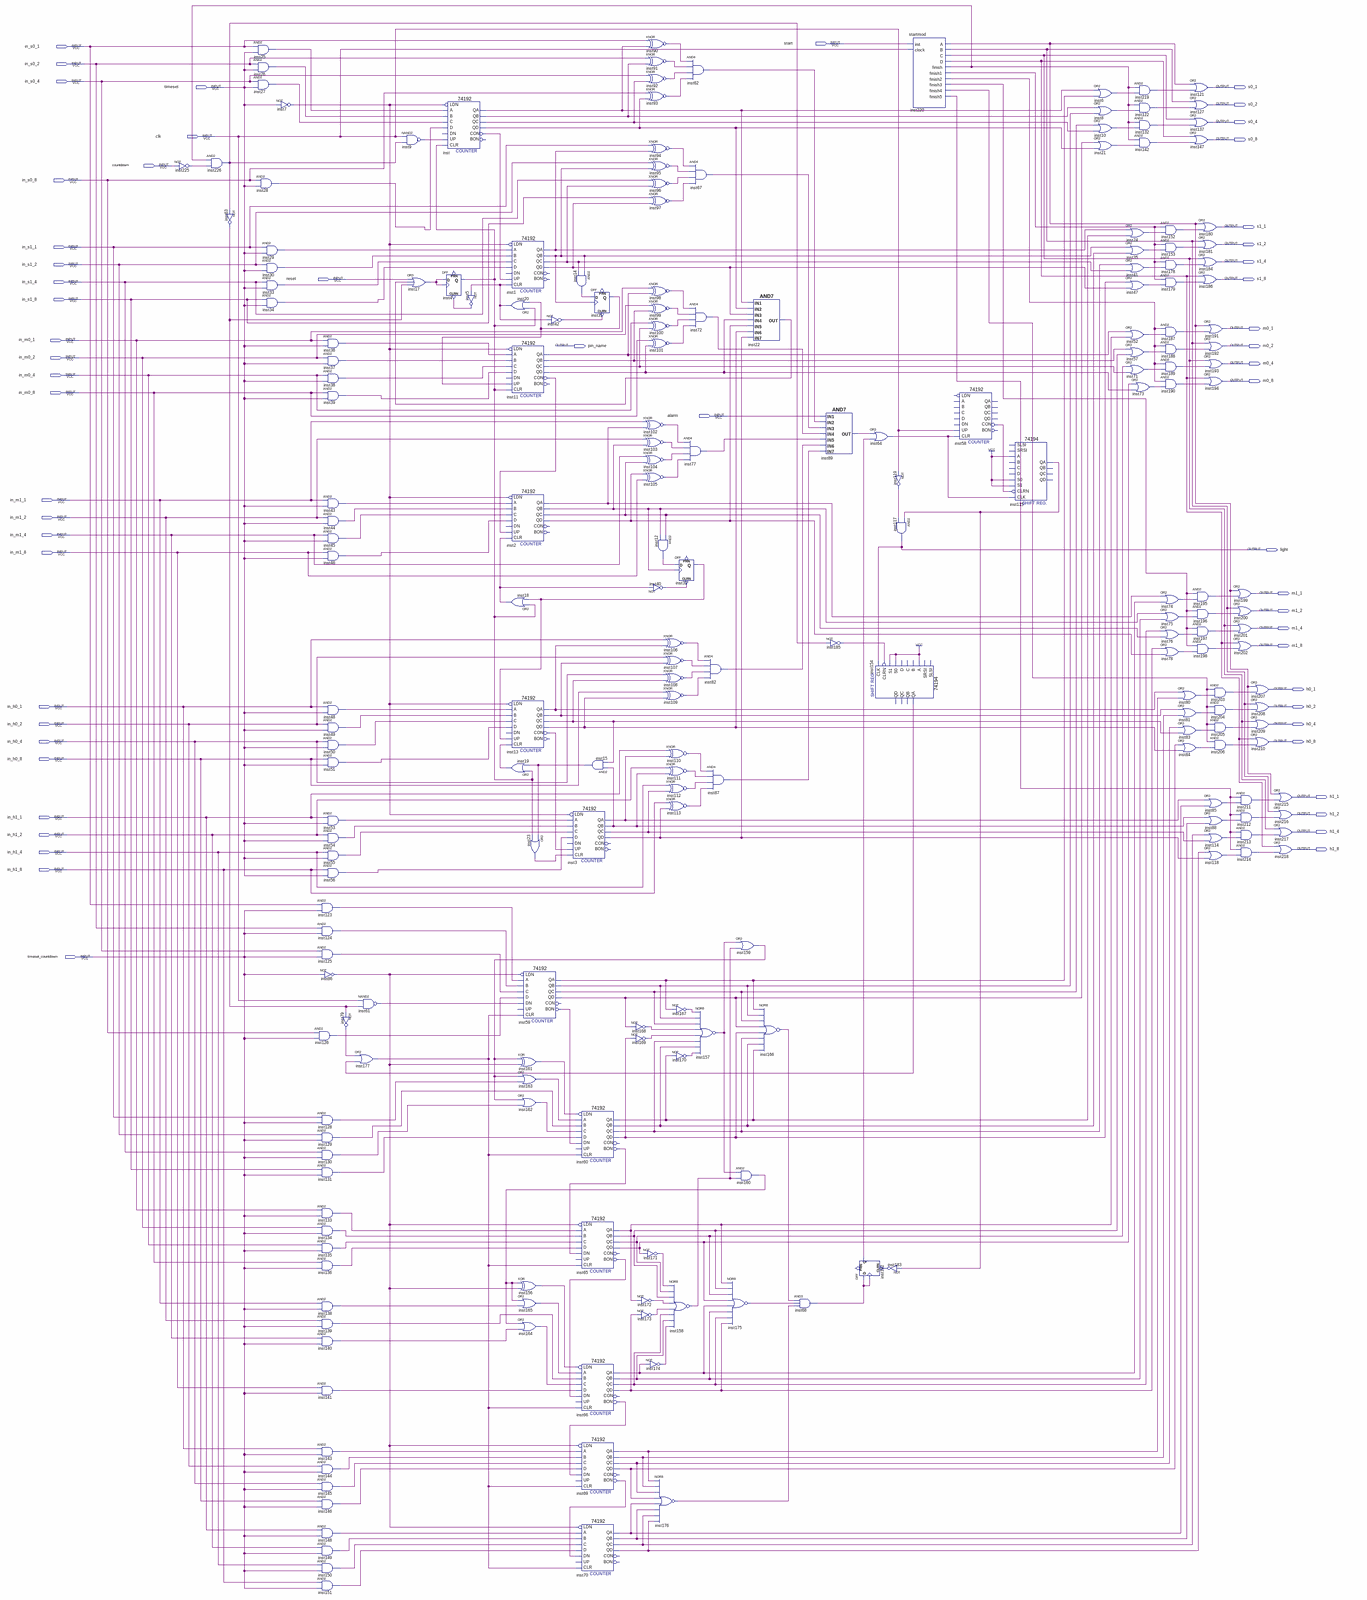
[diagram p0: schematic sheet, whole]
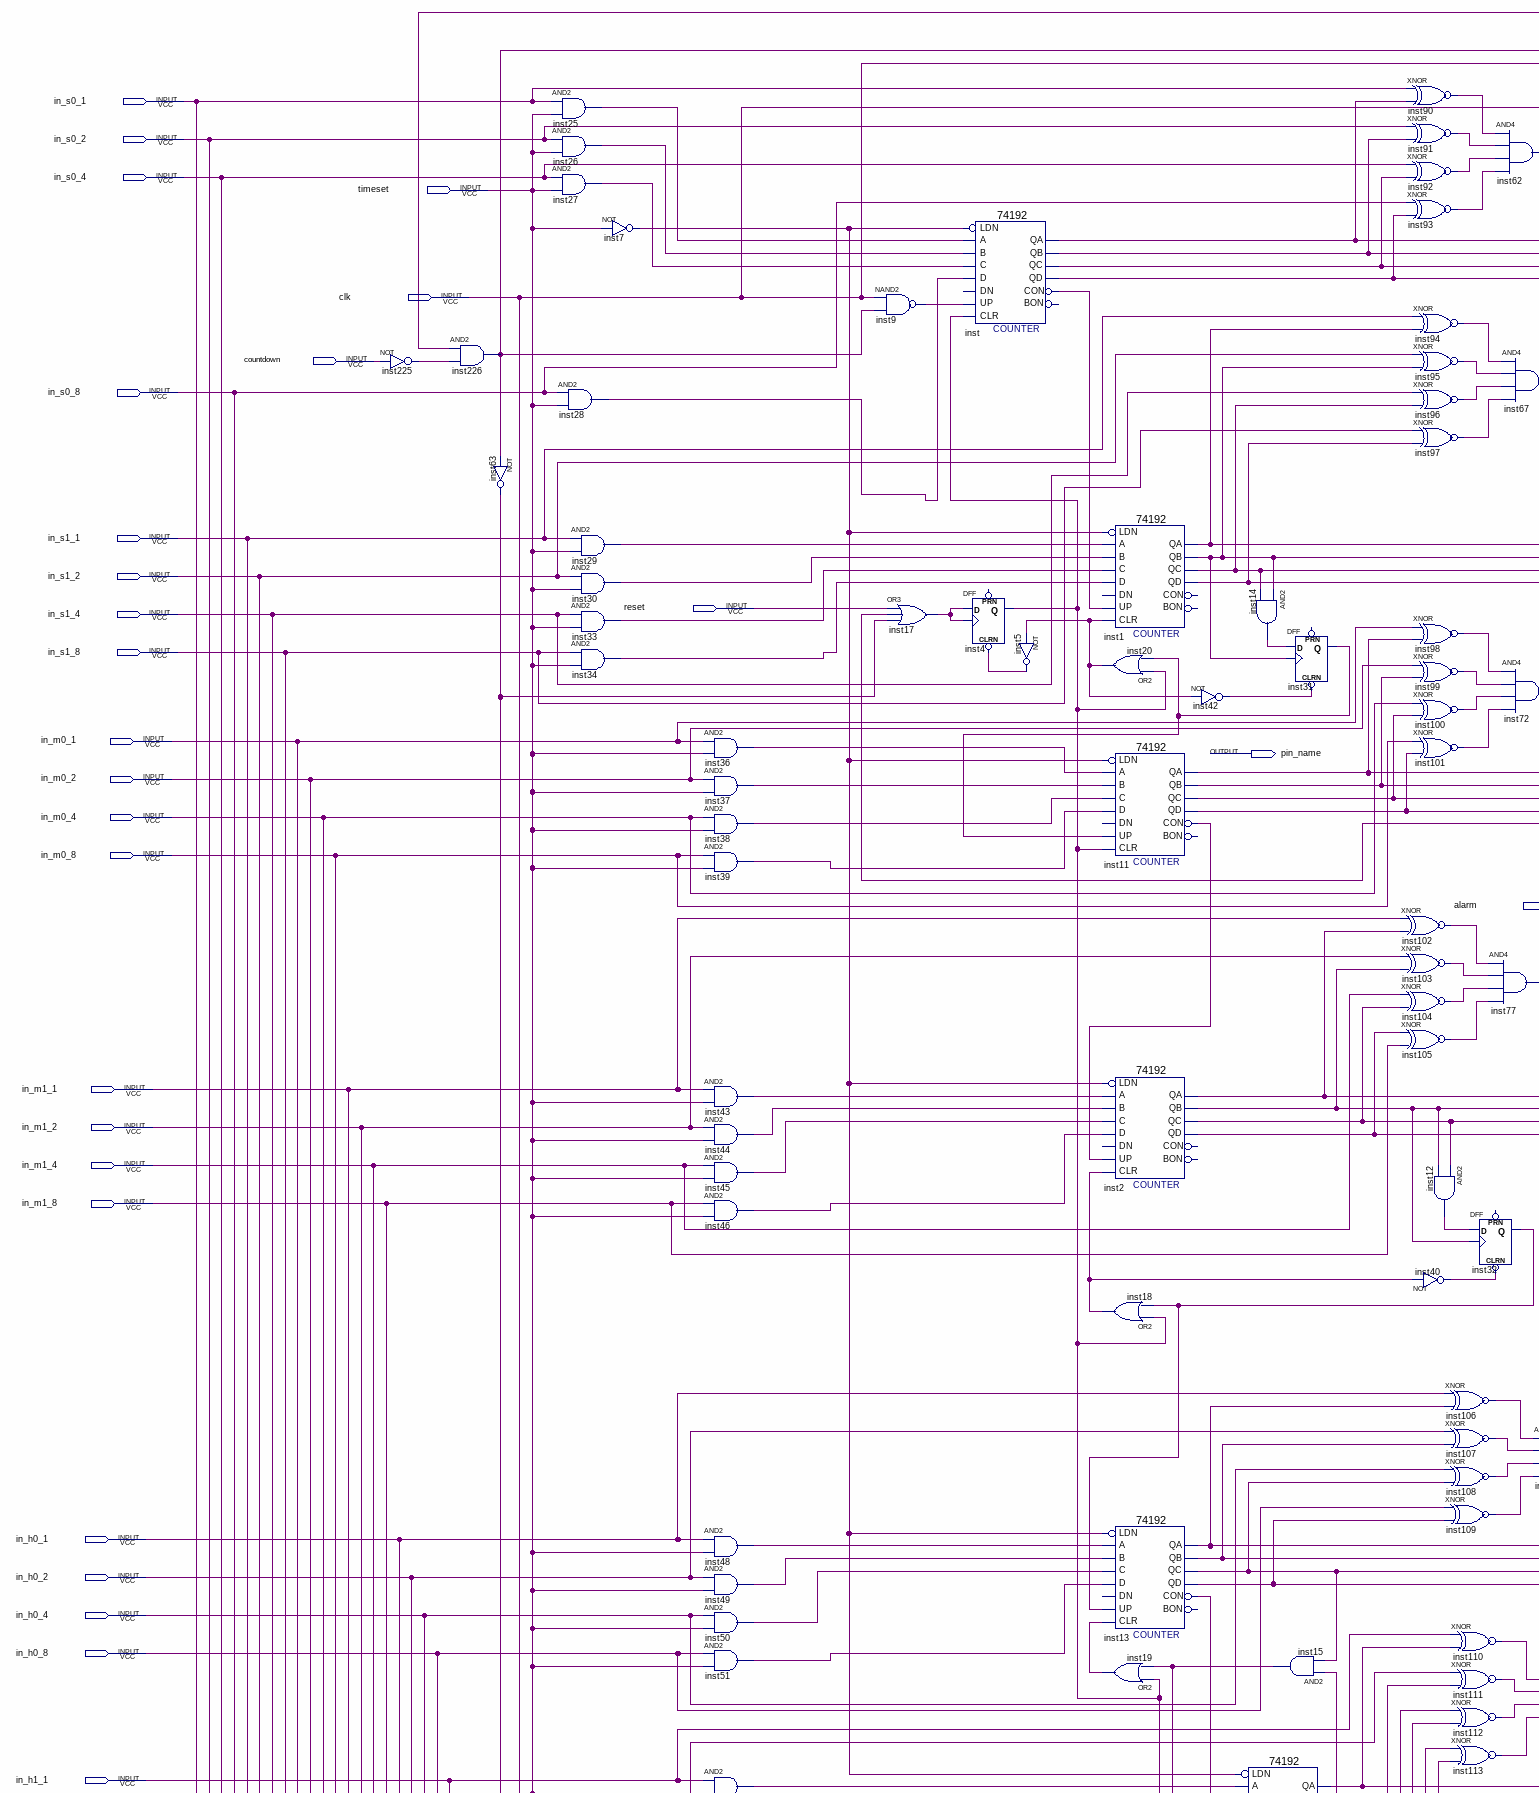
[diagram p1: schematic sheet, upper left part]
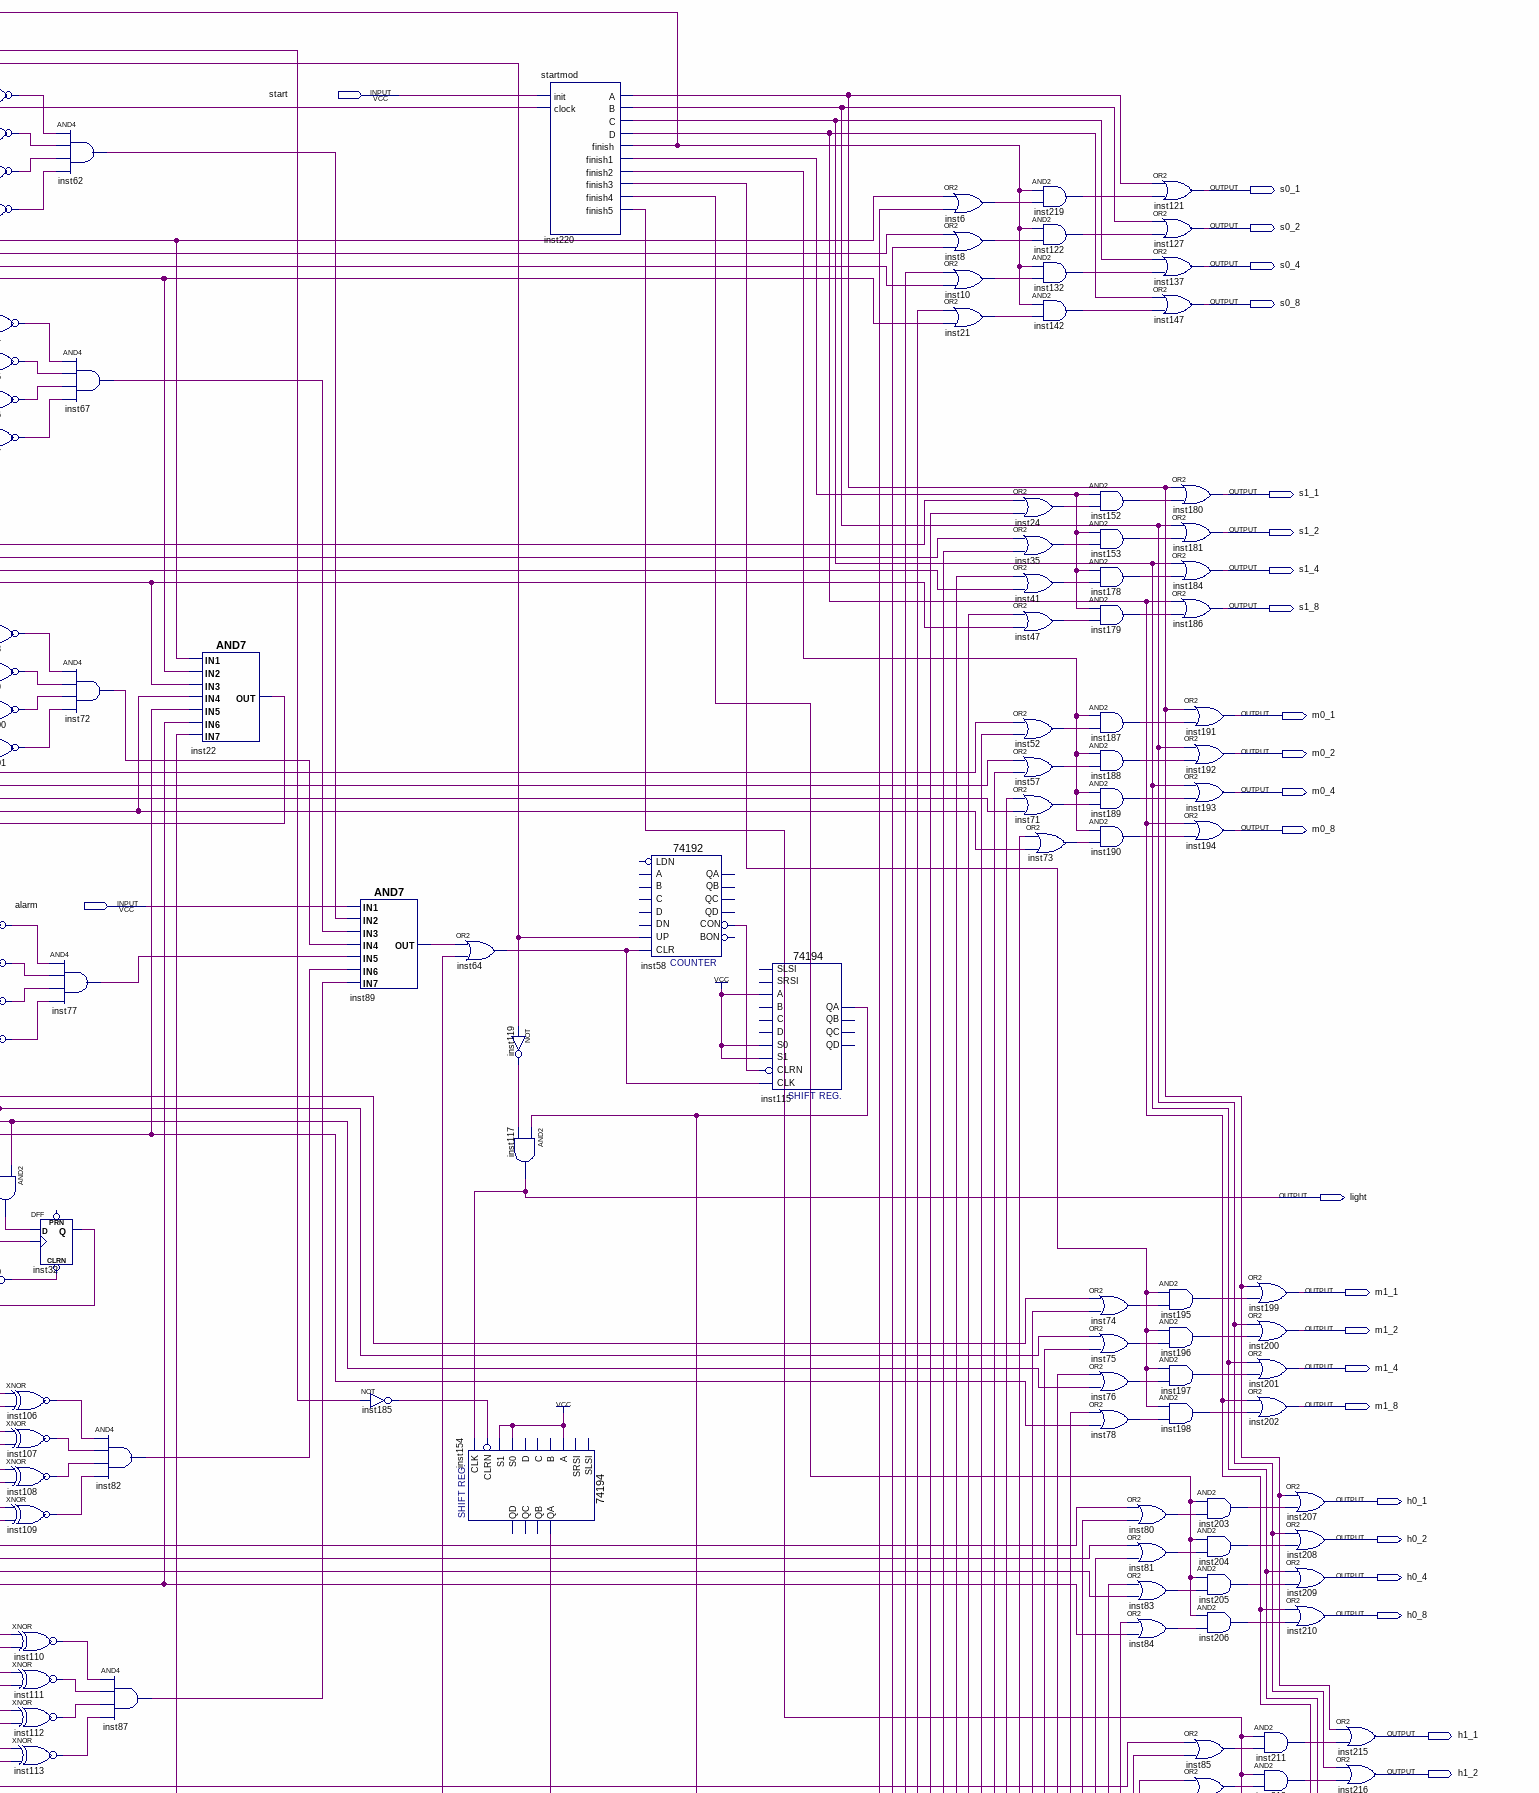
[diagram p2: schematic sheet, upper right part]
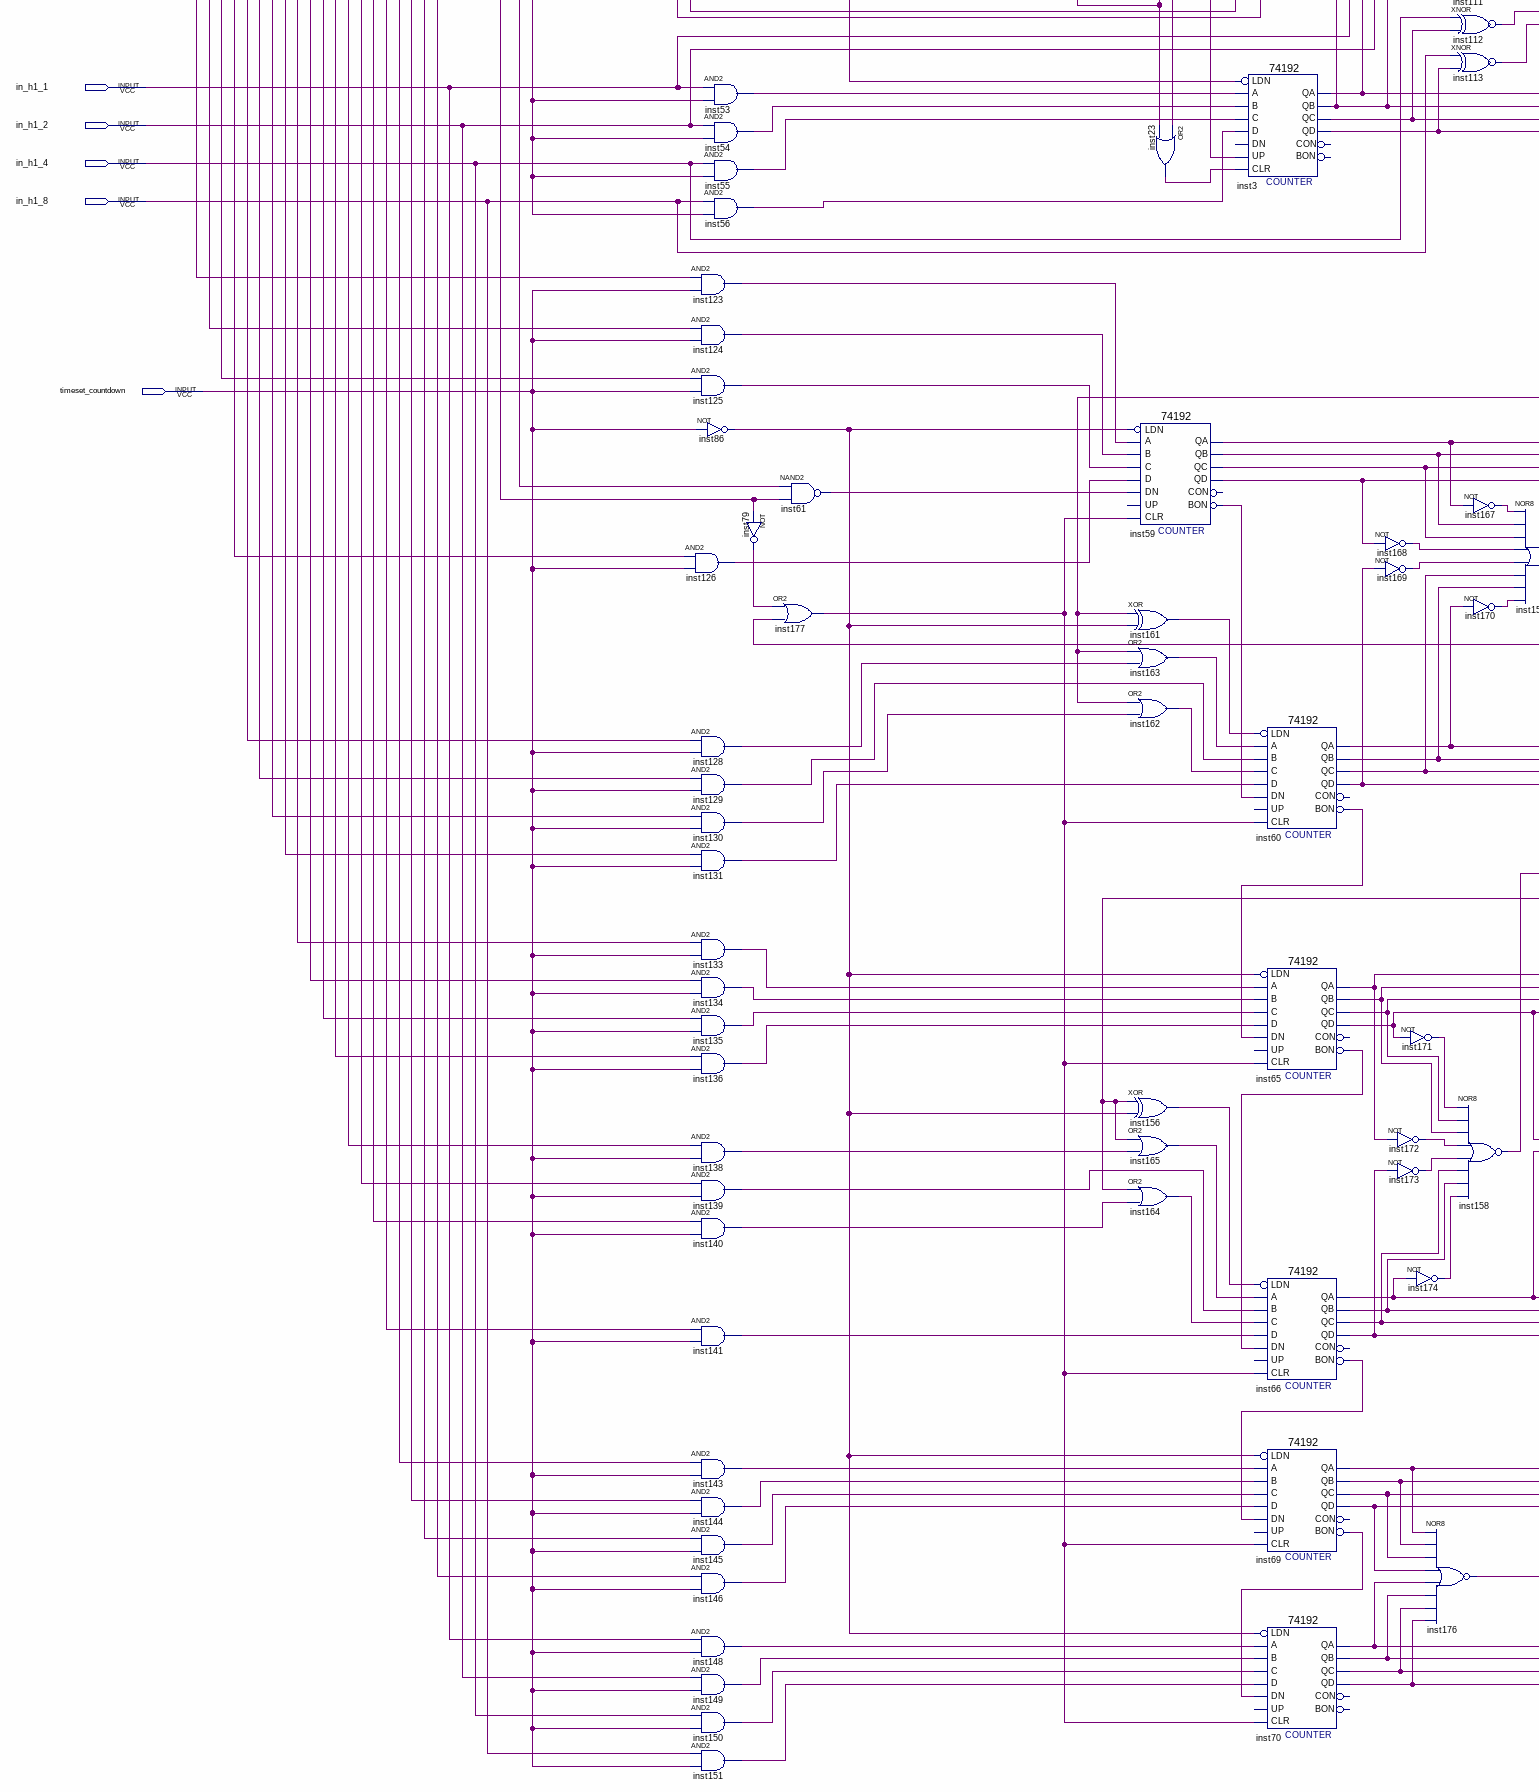
[diagram p3: schematic sheet, lower left part]
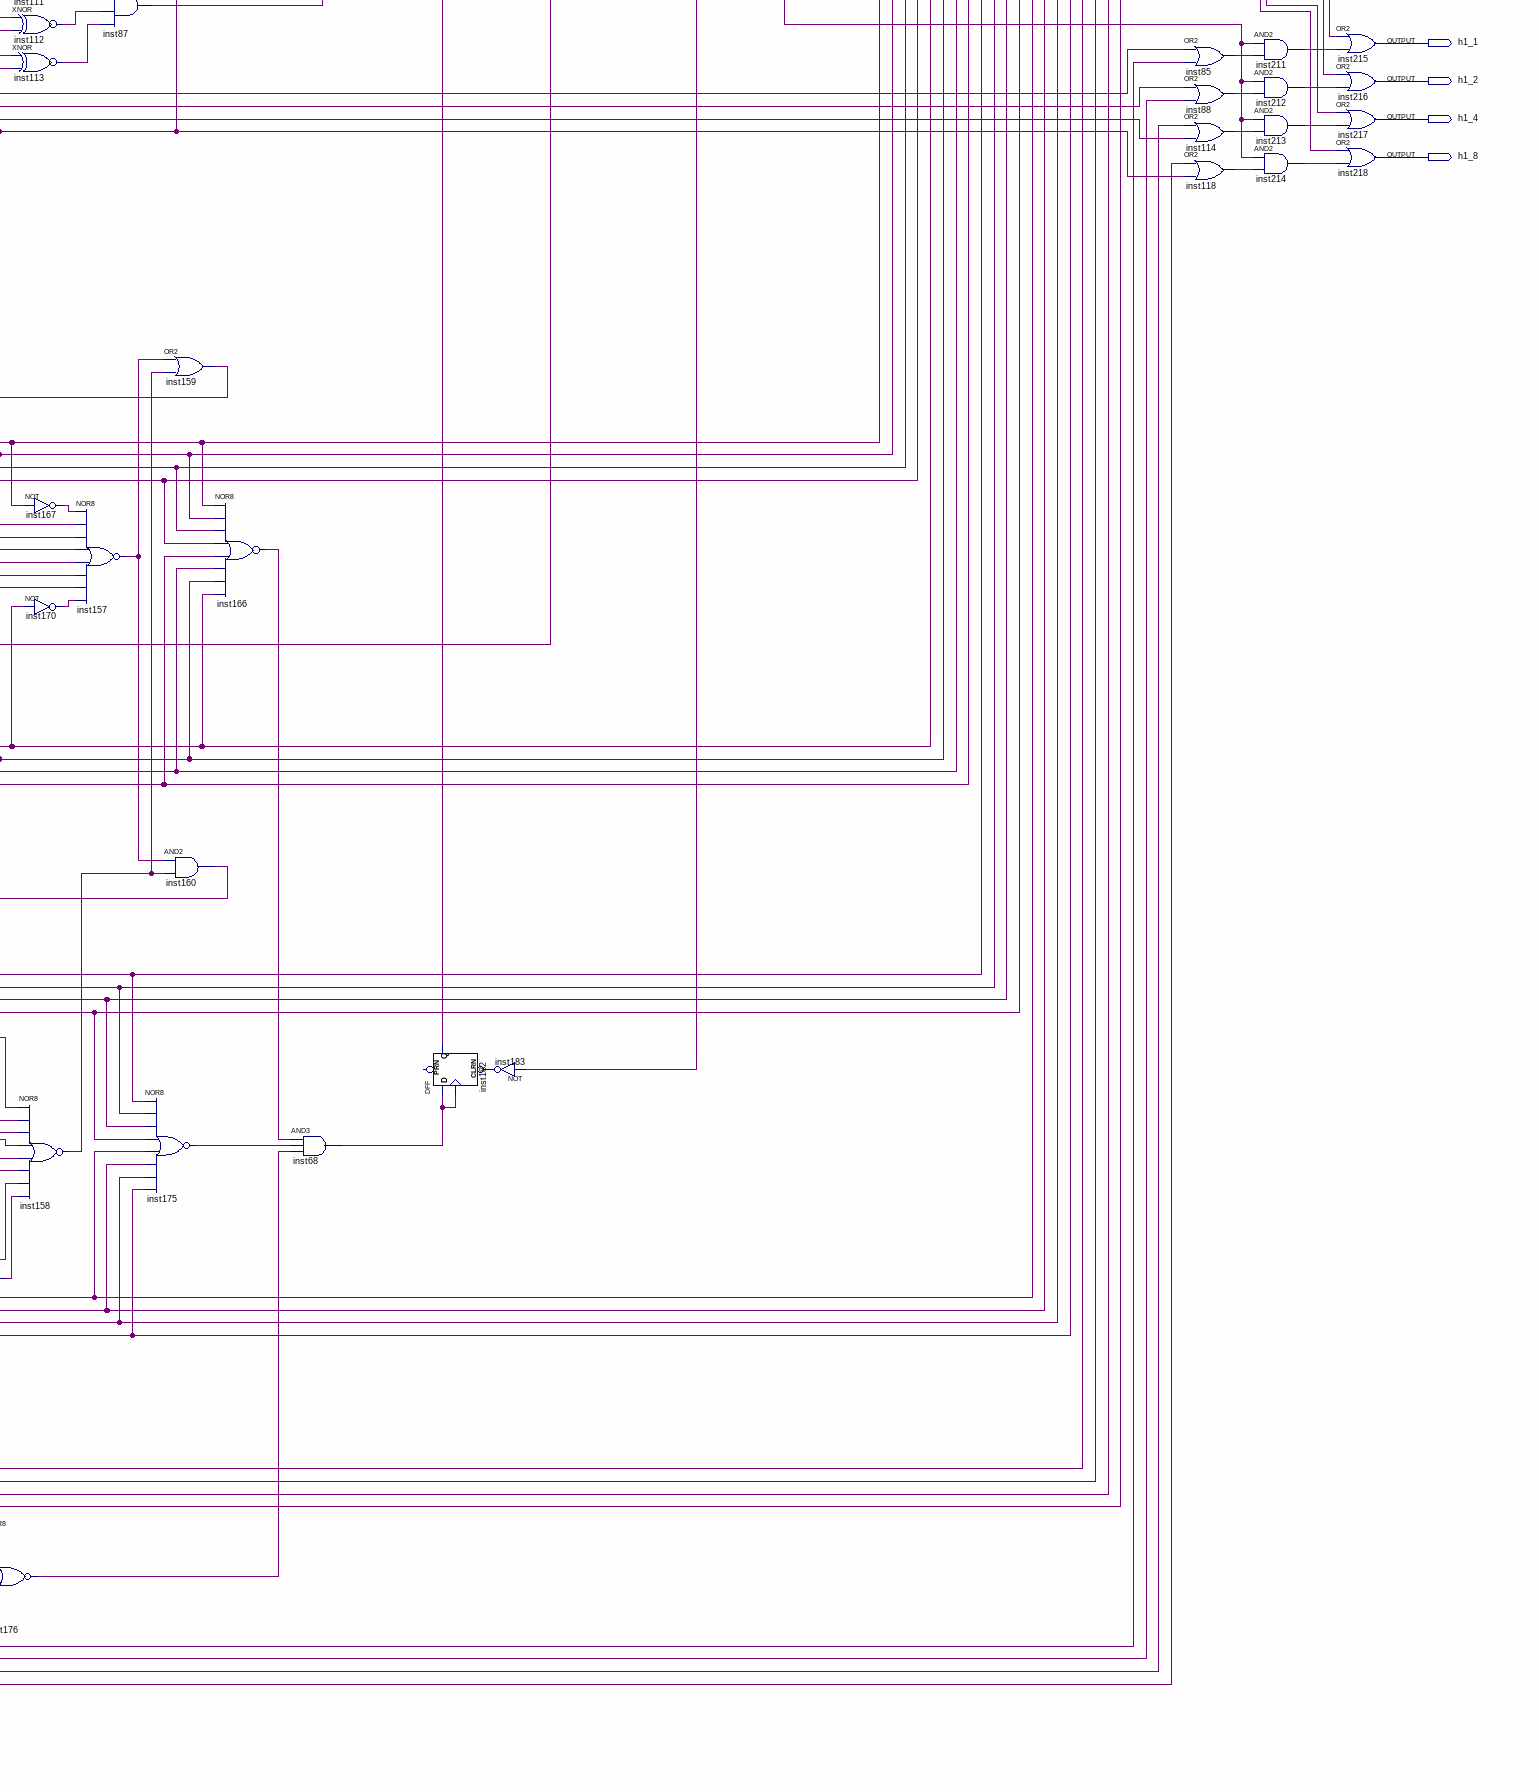
[diagram p4: schematic sheet, lower right part]
// Quartus schematic clock.bdf as structural Verilog: 219 symbols, 57 pins
module clock (
  input  start,
  input  in_s0_1,
  input  in_s0_2,
  input  in_s0_4,
  input  timeset,
  input  clk,
  input  countdown,
  input  in_s0_8,
  input  in_s1_1,
  input  in_s1_2,
  input  reset,
  input  in_s1_4,
  input  in_s1_8,
  input  in_m0_1,
  input  in_m0_2,
  input  in_m0_4,
  input  in_m0_8,
  input  alarm,
  input  in_m1_1,
  input  in_m1_2,
  input  in_m1_4,
  input  in_m1_8,
  input  in_h0_1,
  input  in_h0_2,
  input  in_h0_4,
  input  in_h0_8,
  input  in_h1_1,
  input  in_h1_2,
  input  in_h1_4,
  input  in_h1_8,
  input  timeset_countdown,
  output s0_1,
  output s0_2,
  output s0_4,
  output s0_8,
  output s1_1,
  output s1_2,
  output s1_4,
  output s1_8,
  output m0_1,
  output pin_name,
  output m0_2,
  output m0_4,
  output m0_8,
  output light,
  output m1_1,
  output m1_2,
  output m1_4,
  output m1_8,
  output h0_1,
  output h0_2,
  output h0_4,
  output h0_8,
  output h1_1,
  output h1_2,
  output h1_4,
  output h1_8
);

  wire inst1_qa, inst1_qb, inst1_qc, inst1_qd, inst2_qa, inst2_qb, inst2_qc, inst2_qd, inst3_qa, inst3_qb,
       inst3_qc, inst3_qd, inst4_q, inst5_out, inst6_out, inst7_out, inst8_out, inst9_out, inst10_out,
       inst11_con, inst11_qa, inst11_qb, inst11_qc, inst11_qd, inst12_out, inst13_con, inst13_qa, inst13_qb,
       inst13_qc, inst13_qd, inst14_out, inst15_out, inst17_out, inst18_out, inst19_out, inst20_out,
       inst21_out, inst22_out, inst23_out, inst24_out, inst25_out, inst26_out, inst27_out, inst28_out,
       inst29_out, inst30_out, inst31_q, inst32_q, inst33_out, inst34_out, inst35_out, inst36_out,
       inst37_out, inst38_out, inst39_out, inst40_out, inst41_out, inst42_out, inst43_out, inst44_out,
       inst45_out, inst46_out, inst47_out, inst48_out, inst49_out, inst50_out, inst51_out, inst52_out,
       inst53_out, inst54_out, inst55_out, inst56_out, inst57_out, inst58_con, inst59_bon, inst59_qa,
       inst59_qb, inst59_qc, inst59_qd, inst60_bon, inst60_qa, inst60_qb, inst60_qc, inst60_qd, inst61_out,
       inst62_out, inst63_out, inst64_out, inst65_bon, inst65_qa, inst65_qb, inst65_qc, inst65_qd,
       inst66_bon, inst66_qa, inst66_qb, inst66_qc, inst66_qd, inst67_out, inst68_out, inst69_bon, inst69_qa,
       inst69_qb, inst69_qc, inst69_qd, inst70_qa, inst70_qb, inst70_qc, inst70_qd, inst71_out, inst72_out,
       inst73_out, inst74_out, inst75_out, inst76_out, inst77_out, inst78_out, inst79_out, inst80_out,
       inst81_out, inst82_out, inst83_out, inst84_out, inst85_out, inst86_out, inst87_out, inst88_out,
       inst89_out, inst90_out, inst91_out, inst92_out, inst93_out, inst94_out, inst95_out, inst96_out,
       inst97_out, inst98_out, inst99_out, inst100_out, inst101_out, inst102_out, inst103_out, inst104_out,
       inst105_out, inst106_out, inst107_out, inst108_out, inst109_out, inst110_out, inst111_out,
       inst112_out, inst113_out, inst114_out, inst115_qa, inst118_out, inst119_out, inst122_out, inst123_out,
       inst124_out, inst125_out, inst126_out, inst128_out, inst129_out, inst130_out, inst131_out,
       inst132_out, inst133_out, inst134_out, inst135_out, inst136_out, inst138_out, inst139_out,
       inst140_out, inst141_out, inst142_out, inst143_out, inst144_out, inst145_out, inst146_out,
       inst148_out, inst149_out, inst150_out, inst151_out, inst152_out, inst153_out, inst154_qa, inst156_out,
       inst157_out, inst158_out, inst159_out, inst160_out, inst161_out, inst162_out, inst163_out,
       inst164_out, inst165_out, inst166_out, inst167_out, inst168_out, inst169_out, inst170_out,
       inst171_out, inst172_out, inst173_out, inst174_out, inst175_out, inst176_out, inst177_out,
       inst178_out, inst179_out, inst182_q, inst183_out, inst185_out, inst187_out, inst188_out, inst189_out,
       inst190_out, inst195_out, inst196_out, inst197_out, inst198_out, inst203_out, inst204_out,
       inst205_out, inst206_out, inst211_out, inst212_out, inst213_out, inst214_out, inst219_out, inst220_a,
       inst220_b, inst220_c, inst220_d, inst220_finish, inst220_finish1, inst220_finish2, inst220_finish3,
       inst220_finish4, inst220_finish5, inst225_out, inst226_out, inst_con, inst_qa, inst_qb, inst_qc,
       inst_qd;

  not inst225 (inst225_out, countdown);
  and inst226 (inst226_out, inst220_finish, inst225_out);
  not inst63 (inst63_out, inst226_out);
  and inst25 (inst25_out, in_s0_1, timeset);
  and inst26 (inst26_out, in_s0_2, timeset);
  and inst27 (inst27_out, in_s0_4, timeset);
  not inst7 (inst7_out, timeset);
  and inst28 (inst28_out, in_s0_8, timeset);
  and inst29 (inst29_out, in_s1_1, timeset);
  and inst30 (inst30_out, in_s1_2, timeset);
  and inst33 (inst33_out, in_s1_4, timeset);
  and inst34 (inst34_out, in_s1_8, timeset);
  and inst36 (inst36_out, in_m0_1, timeset);
  and inst37 (inst37_out, in_m0_2, timeset);
  and inst38 (inst38_out, in_m0_4, timeset);
  and inst39 (inst39_out, in_m0_8, timeset);
  and inst43 (inst43_out, in_m1_1, timeset);
  and inst44 (inst44_out, in_m1_2, timeset);
  and inst45 (inst45_out, in_m1_4, timeset);
  and inst46 (inst46_out, in_m1_8, timeset);
  and inst48 (inst48_out, in_h0_1, timeset);
  and inst49 (inst49_out, in_h0_2, timeset);
  and inst50 (inst50_out, in_h0_4, timeset);
  and inst51 (inst51_out, in_h0_8, timeset);
  and inst53 (inst53_out, in_h1_1, timeset);
  and inst54 (inst54_out, in_h1_2, timeset);
  and inst55 (inst55_out, in_h1_4, timeset);
  and inst56 (inst56_out, in_h1_8, timeset);
  and inst123 (inst123_out, in_s0_1, timeset_countdown);
  and inst124 (inst124_out, in_s0_2, timeset_countdown);
  and inst125 (inst125_out, in_s0_4, timeset_countdown);
  not inst86 (inst86_out, timeset_countdown);
  and inst126 (inst126_out, in_s0_8, timeset_countdown);
  and inst128 (inst128_out, in_s1_1, timeset_countdown);
  and inst129 (inst129_out, in_s1_2, timeset_countdown);
  and inst130 (inst130_out, in_s1_4, timeset_countdown);
  and inst131 (inst131_out, in_s1_8, timeset_countdown);
  and inst133 (inst133_out, in_m0_1, timeset_countdown);
  and inst134 (inst134_out, in_m0_2, timeset_countdown);
  and inst135 (inst135_out, in_m0_4, timeset_countdown);
  and inst136 (inst136_out, in_m0_8, timeset_countdown);
  and inst138 (inst138_out, in_m1_1, timeset_countdown);
  and inst139 (inst139_out, in_m1_2, timeset_countdown);
  and inst140 (inst140_out, in_m1_4, timeset_countdown);
  and inst141 (inst141_out, in_m1_8, timeset_countdown);
  and inst143 (inst143_out, in_h0_1, timeset_countdown);
  and inst144 (inst144_out, in_h0_2, timeset_countdown);
  and inst145 (inst145_out, in_h0_4, timeset_countdown);
  and inst146 (inst146_out, in_h0_8, timeset_countdown);
  and inst148 (inst148_out, in_h1_1, timeset_countdown);
  and inst149 (inst149_out, in_h1_2, timeset_countdown);
  and inst150 (inst150_out, in_h1_4, timeset_countdown);
  and inst151 (inst151_out, in_h1_8, timeset_countdown);
  not inst79 (inst79_out, inst63_out);
  nand inst61 (inst61_out, clk, inst63_out);
  or inst177 (inst177_out, inst79_out, inst154_qa);
  nand inst9 (inst9_out, clk, inst226_out);
  or inst17 (inst17_out, reset, inst22_out, inst63_out);
  \74192  inst (
    .D(inst28_out), .C(inst27_out), .A(inst25_out), .B(inst26_out), .CLR(inst4_q), .UP(inst9_out),
    .LDN(inst7_out), .QB(inst_qb), .CON(inst_con), .QA(inst_qa), .QC(inst_qc), .QD(inst_qd));  // open: DN, BON
  DFF inst4 (.CLRN(inst5_out), .CLK(inst17_out), .D(inst17_out), .Q(inst4_q));  // open: PRN
  not inst5 (inst5_out, inst20_out);
  \74192  inst1 (
    .D(inst34_out), .C(inst33_out), .A(inst29_out), .B(inst30_out), .CLR(inst20_out), .UP(inst_con),
    .LDN(inst7_out), .QB(inst1_qb), .QA(inst1_qa), .QC(inst1_qc), .QD(inst1_qd));  // open: DN, BON, CON
  or inst20 (inst20_out, inst4_q, inst31_q);
  \74192  inst11 (
    .D(inst39_out), .C(inst38_out), .A(inst36_out), .B(inst37_out), .CLR(inst4_q), .UP(inst31_q),
    .LDN(inst7_out), .QB(inst11_qb), .CON(inst11_con), .QA(inst11_qa), .QC(inst11_qc), .QD(inst11_qd));  // open: DN, BON
  \74192  inst2 (
    .D(inst46_out), .C(inst45_out), .A(inst43_out), .B(inst44_out), .CLR(inst18_out), .UP(inst11_con),
    .LDN(inst7_out), .QB(inst2_qb), .QA(inst2_qa), .QC(inst2_qc), .QD(inst2_qd));  // open: DN, BON, CON
  or inst18 (inst18_out, inst4_q, inst32_q);
  \74192  inst13 (
    .D(inst51_out), .C(inst50_out), .A(inst48_out), .B(inst49_out), .CLR(inst19_out), .UP(inst32_q),
    .LDN(inst7_out), .QB(inst13_qb), .CON(inst13_con), .QA(inst13_qa), .QC(inst13_qc), .QD(inst13_qd));  // open: DN, BON
  or inst19 (inst19_out, inst4_q, inst15_out);
  or inst23 (inst23_out, inst15_out, inst4_q);
  \74192  inst59 (
    .D(inst126_out), .C(inst125_out), .A(inst123_out), .B(inst124_out), .CLR(inst177_out), .DN(inst61_out),
    .LDN(inst86_out), .QB(inst59_qb), .BON(inst59_bon), .QA(inst59_qa), .QC(inst59_qc), .QD(inst59_qd));  // open: UP, CON
  xor inst161 (inst161_out, inst159_out, inst86_out);
  or inst163 (inst163_out, inst159_out, inst128_out);
  or inst162 (inst162_out, inst159_out, inst130_out);
  xor inst156 (inst156_out, inst160_out, inst86_out);
  or inst165 (inst165_out, inst160_out, inst138_out);
  or inst164 (inst164_out, inst160_out, inst140_out);
  not inst42 (inst42_out, inst20_out);
  and inst14 (inst14_out, inst1_qb, inst1_qc);
  \74192  inst3 (
    .D(inst56_out), .C(inst55_out), .A(inst53_out), .B(inst54_out), .CLR(inst23_out), .UP(inst13_con),
    .LDN(inst7_out), .QB(inst3_qb), .QA(inst3_qa), .QC(inst3_qc), .QD(inst3_qd));  // open: DN, BON, CON
  \74192  inst60 (
    .D(inst131_out), .C(inst162_out), .A(inst163_out), .B(inst129_out), .CLR(inst177_out), .DN(inst59_bon),
    .LDN(inst161_out), .QB(inst60_qb), .BON(inst60_bon), .QA(inst60_qa), .QC(inst60_qc), .QD(inst60_qd));  // open: UP, CON
  \74192  inst65 (
    .D(inst136_out), .C(inst135_out), .A(inst133_out), .B(inst134_out), .CLR(inst177_out), .DN(inst60_bon),
    .LDN(inst86_out), .QB(inst65_qb), .BON(inst65_bon), .QA(inst65_qa), .QC(inst65_qc), .QD(inst65_qd));  // open: UP, CON
  \74192  inst66 (
    .D(inst141_out), .C(inst164_out), .A(inst165_out), .B(inst139_out), .CLR(inst177_out), .DN(inst65_bon),
    .LDN(inst156_out), .QB(inst66_qb), .BON(inst66_bon), .QA(inst66_qa), .QC(inst66_qc), .QD(inst66_qd));  // open: UP, CON
  \74192  inst69 (
    .D(inst146_out), .C(inst145_out), .A(inst143_out), .B(inst144_out), .CLR(inst177_out), .DN(inst66_bon),
    .LDN(inst86_out), .QB(inst69_qb), .BON(inst69_bon), .QA(inst69_qa), .QC(inst69_qc), .QD(inst69_qd));  // open: UP, CON
  \74192  inst70 (
    .D(inst151_out), .C(inst150_out), .A(inst148_out), .B(inst149_out), .CLR(inst177_out), .DN(inst69_bon),
    .LDN(inst86_out), .QB(inst70_qb), .QA(inst70_qa), .QC(inst70_qc), .QD(inst70_qd));  // open: UP, BON, CON
  DFF inst31 (.CLRN(inst42_out), .CLK(inst1_qb), .D(inst14_out), .Q(inst31_q));  // open: PRN
  and inst15 (inst15_out, inst3_qb, inst13_qc);
  xnor inst90 (inst90_out, in_s0_1, inst_qa);
  xnor inst91 (inst91_out, in_s0_2, inst_qb);
  xnor inst92 (inst92_out, in_s0_4, inst_qc);
  xnor inst93 (inst93_out, in_s0_8, inst_qd);
  xnor inst94 (inst94_out, in_s1_1, inst1_qa);
  xnor inst95 (inst95_out, in_s1_2, inst1_qb);
  xnor inst96 (inst96_out, in_s1_4, inst1_qc);
  xnor inst97 (inst97_out, in_s1_8, inst1_qd);
  xnor inst98 (inst98_out, in_m0_1, inst11_qa);
  xnor inst99 (inst99_out, in_m0_2, inst11_qb);
  xnor inst100 (inst100_out, in_m0_4, inst11_qc);
  xnor inst101 (inst101_out, in_m0_8, inst11_qd);
  xnor inst102 (inst102_out, in_m1_1, inst2_qa);
  xnor inst103 (inst103_out, in_m1_2, inst2_qb);
  xnor inst104 (inst104_out, in_m1_4, inst2_qc);
  xnor inst105 (inst105_out, inst2_qd, in_m1_8);
  not inst40 (inst40_out, inst18_out);
  not inst168 (inst168_out, inst59_qd);
  not inst169 (inst169_out, inst60_qd);
  not inst171 (inst171_out, inst65_qd);
  not inst172 (inst172_out, inst65_qa);
  not inst173 (inst173_out, inst66_qd);
  not inst174 (inst174_out, inst66_qa);
  and inst12 (inst12_out, inst2_qc, inst2_qb);
  xnor inst106 (inst106_out, in_h0_1, inst13_qa);
  xnor inst107 (inst107_out, in_h0_2, inst13_qb);
  xnor inst108 (inst108_out, in_h0_4, inst13_qc);
  xnor inst109 (inst109_out, in_h0_8, inst13_qd);
  xnor inst110 (inst110_out, in_h1_1, inst3_qa);
  xnor inst111 (inst111_out, in_h1_2, inst3_qb);
  xnor inst112 (inst112_out, in_h1_4, inst3_qc);
  xnor inst113 (inst113_out, in_h1_8, inst3_qd);
  not inst167 (inst167_out, inst59_qa);
  not inst170 (inst170_out, inst60_qa);
  nor inst158 (inst158_out, inst171_out, inst65_qc, inst65_qb, inst172_out, inst173_out, inst66_qc, inst66_qb, inst174_out);
  nor inst176 (inst176_out, inst69_qa, inst69_qb, inst69_qc, inst69_qd, inst70_qa, inst70_qb, inst70_qc, inst70_qd);
  and inst62 (inst62_out, inst90_out, inst91_out, inst92_out, inst93_out);
  and inst67 (inst67_out, inst94_out, inst95_out, inst96_out, inst97_out);
  and inst72 (inst72_out, inst98_out, inst99_out, inst100_out, inst101_out);
  and inst77 (inst77_out, inst102_out, inst103_out, inst104_out, inst105_out);
  DFF inst32 (.CLRN(inst40_out), .CLK(inst2_qb), .D(inst12_out), .Q(inst32_q));  // open: PRN
  nor inst157 (inst157_out, inst167_out, inst59_qb, inst59_qc, inst168_out, inst169_out, inst60_qc, inst60_qb, inst170_out);
  and inst82 (inst82_out, inst106_out, inst107_out, inst108_out, inst109_out);
  and inst87 (inst87_out, inst110_out, inst111_out, inst112_out, inst113_out);
  or inst159 (inst159_out, inst157_out, inst158_out);
  and inst160 (inst160_out, inst157_out, inst158_out);
  nor inst175 (inst175_out, inst65_qa, inst65_qb, inst65_qc, inst65_qd, inst66_qa, inst66_qb, inst66_qc, inst66_qd);
  and inst22 (inst22_out, inst_qa, inst_qd, inst1_qd, inst11_qd, inst2_qd, inst13_qd, inst3_qd);
  nor inst166 (inst166_out, inst59_qa, inst59_qb, inst59_qc, inst59_qd, inst60_qd, inst60_qc, inst60_qb, inst60_qa);
  and inst68 (inst68_out, inst166_out, inst175_out, inst176_out);
  and inst89 (inst89_out, alarm, inst62_out, inst67_out, inst72_out, inst77_out, inst82_out, inst87_out);
  not inst185 (inst185_out, inst226_out);
  DFF inst182 (.CLRN(inst183_out), .CLK(inst68_out), .D(inst68_out), .Q(inst182_q));  // open: PRN
  or inst64 (inst64_out, inst89_out, inst182_q);
  \74194  inst154 (
    .CLK(light), .CLRN(inst185_out), .S1(1'b1), .S0(1'b1), .A(1'b1), .QA(inst154_qa));  // open: SLSI, SRSI, B, C, D, QB, QC, QD
  not inst119 (inst119_out, clk);
  and inst117 (light, inst115_qa, inst119_out);
  not inst183 (inst183_out, inst115_qa);
  startmod inst220 (
    .init(start), .clock(clk), .A(inst220_a), .B(inst220_b), .C(inst220_c), .D(inst220_d),
    .finish(inst220_finish), .finish1(inst220_finish1), .finish2(inst220_finish2), .finish3(inst220_finish3),
    .finish4(inst220_finish4), .finish5(inst220_finish5));
  \74192  inst58 (.CLR(inst64_out), .UP(clk), .CON(inst58_con));  // open: D, C, A, B, DN, LDN, QB, BON, QA, QC, QD
  \74194  inst115 (
    .CLK(inst64_out), .CLRN(inst58_con), .S1(1'b1), .S0(1'b1), .A(1'b1), .QA(inst115_qa));  // open: SLSI, SRSI, B, C, D, QB, QC, QD
  or inst6 (inst6_out, inst_qa, inst59_qa);
  or inst8 (inst8_out, inst_qb, inst59_qb);
  or inst10 (inst10_out, inst59_qc, inst_qc);
  or inst21 (inst21_out, inst59_qd, inst_qd);
  and inst219 (inst219_out, inst220_finish, inst6_out);
  and inst122 (inst122_out, inst220_finish, inst8_out);
  and inst132 (inst132_out, inst220_finish, inst10_out);
  and inst142 (inst142_out, inst220_finish, inst21_out);
  or inst24 (inst24_out, inst1_qa, inst60_qa);
  or inst35 (inst35_out, inst1_qb, inst60_qb);
  or inst41 (inst41_out, inst60_qc, inst1_qc);
  or inst47 (inst47_out, inst60_qd, inst1_qd);
  or inst52 (inst52_out, inst11_qa, inst65_qa);
  or inst57 (inst57_out, inst11_qb, inst65_qb);
  or inst71 (inst71_out, inst65_qc, inst11_qc);
  or inst73 (inst73_out, inst65_qd, inst11_qd);
  and inst152 (inst152_out, inst220_finish1, inst24_out);
  and inst153 (inst153_out, inst220_finish1, inst35_out);
  and inst178 (inst178_out, inst220_finish1, inst41_out);
  and inst179 (inst179_out, inst220_finish1, inst47_out);
  and inst187 (inst187_out, inst220_finish2, inst52_out);
  and inst188 (inst188_out, inst220_finish2, inst57_out);
  and inst189 (inst189_out, inst220_finish2, inst71_out);
  and inst190 (inst190_out, inst220_finish2, inst73_out);
  or inst74 (inst74_out, inst2_qa, inst66_qa);
  or inst75 (inst75_out, inst2_qb, inst66_qb);
  or inst76 (inst76_out, inst66_qc, inst2_qc);
  or inst78 (inst78_out, inst66_qd, inst2_qd);
  or inst80 (inst80_out, inst13_qa, inst69_qa);
  or inst81 (inst81_out, inst13_qb, inst69_qb);
  or inst83 (inst83_out, inst69_qc, inst13_qc);
  or inst84 (inst84_out, inst69_qd, inst13_qd);
  or inst121 (s0_1, inst220_a, inst219_out);
  or inst127 (s0_2, inst220_b, inst122_out);
  or inst137 (s0_4, inst220_c, inst132_out);
  or inst147 (s0_8, inst220_d, inst142_out);
  or inst180 (s1_1, inst220_a, inst152_out);
  or inst181 (s1_2, inst220_b, inst153_out);
  or inst184 (s1_4, inst220_c, inst178_out);
  or inst186 (s1_8, inst220_d, inst179_out);
  or inst191 (m0_1, inst220_a, inst187_out);
  or inst192 (m0_2, inst220_b, inst188_out);
  or inst193 (m0_4, inst220_c, inst189_out);
  or inst194 (m0_8, inst220_d, inst190_out);
  and inst195 (inst195_out, inst220_finish3, inst74_out);
  and inst196 (inst196_out, inst220_finish3, inst75_out);
  and inst197 (inst197_out, inst220_finish3, inst76_out);
  and inst198 (inst198_out, inst220_finish3, inst78_out);
  or inst85 (inst85_out, inst3_qa, inst70_qa);
  or inst88 (inst88_out, inst3_qb, inst70_qb);
  or inst114 (inst114_out, inst70_qc, inst3_qc);
  or inst118 (inst118_out, inst70_qd, inst3_qd);
  and inst203 (inst203_out, inst220_finish4, inst80_out);
  and inst204 (inst204_out, inst220_finish4, inst81_out);
  and inst205 (inst205_out, inst220_finish4, inst83_out);
  and inst206 (inst206_out, inst220_finish4, inst84_out);
  or inst199 (m1_1, inst220_a, inst195_out);
  or inst200 (m1_2, inst220_b, inst196_out);
  or inst201 (m1_4, inst220_c, inst197_out);
  or inst202 (m1_8, inst220_d, inst198_out);
  or inst207 (h0_1, inst220_a, inst203_out);
  or inst208 (h0_2, inst220_b, inst204_out);
  or inst209 (h0_4, inst220_c, inst205_out);
  or inst210 (h0_8, inst220_d, inst206_out);
  and inst211 (inst211_out, inst220_finish5, inst85_out);
  and inst212 (inst212_out, inst220_finish5, inst88_out);
  and inst213 (inst213_out, inst220_finish5, inst114_out);
  and inst214 (inst214_out, inst220_finish5, inst118_out);
  or inst215 (h1_1, inst220_a, inst211_out);
  or inst216 (h1_2, inst220_b, inst212_out);
  or inst217 (h1_4, inst220_c, inst213_out);
  or inst218 (h1_8, inst220_d, inst214_out);
endmodule
